# Altium schematic sheet H2E_Port.SchDoc
size A4
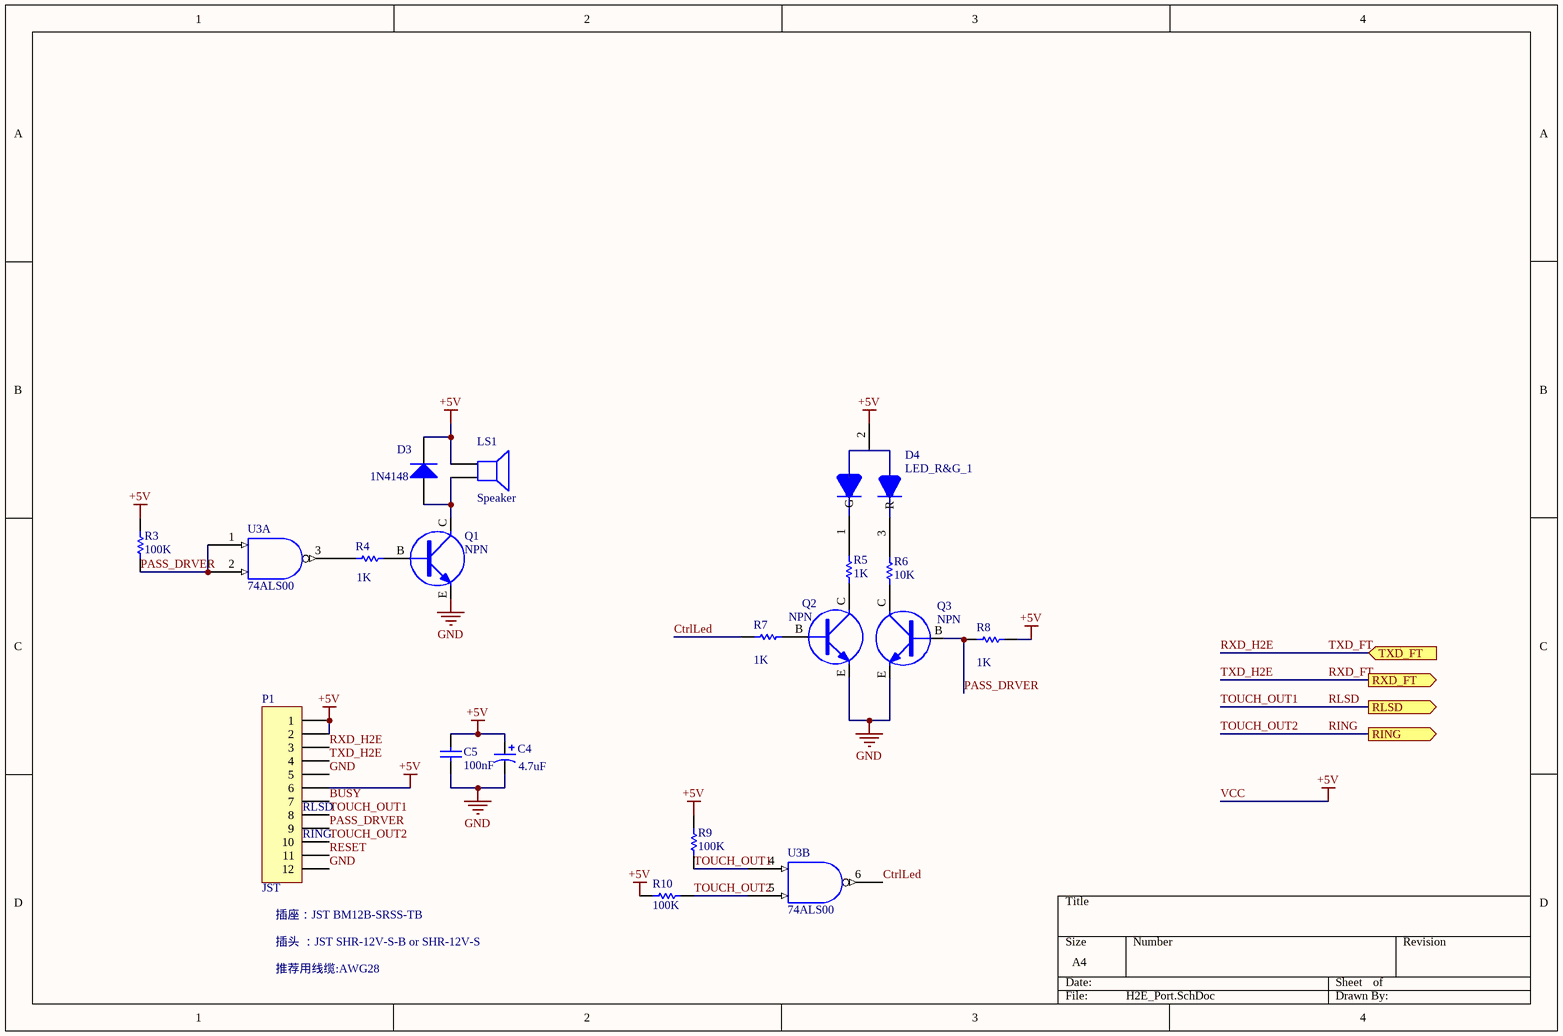
[diagram p0: H2E_Port.SchDoc]

## Parts
C4  value 4.7uF  [T3528]  (hidden comment: CAP+)
C5  value 100nF  [C0603]  (hidden comment: CAP)
D3  1N4148  [D1206]
D4  LED_R&G_1  [LED_R&G]
LS1  Speaker  [BUZZER]
P1  JST  [JST BM12B-SRSS-TB]
Q1  NPN  [SOT23/BEC]
Q2  NPN  [SOT23/BEC]
Q3  NPN  [SOT23/BEC]
R3  value 100K  [R0603]  (hidden comment: Res1)
R4  value 1K  [R0603]  (hidden comment: Res1)
R5  value 1K  [R0603]  (hidden comment: Res1)
R6  value 10K  [R0603]  (hidden comment: Res1)
R7  value 1K  [R0603]  (hidden comment: Res1)
R8  value 1K  [R0603]  (hidden comment: Res1)
R9  value 100K  [R0603]  (hidden comment: Res1)
R10  value 100K  [R0603]  (hidden comment: Res1)
U3  74ALS00  [SOIC-14]  (parts A,B of 4)

## Ports
RING (out), RLSD (out), RXD_FT (out), TXD_FT (in)

## Nets
GND: C4.2 C5.1 P1.5 P1.12 Q1.E Q2.E Q3.E U3.7(GND)
VCC: C4.1 C5.2 D3.2(K) D4.2(P) LS1.1 P1.1 P1.2 P1.6 R3.2 R8.2 R9.2 R10.2 U3.14(VCC)  [also labelled +5V]
BUSY: P1.7
CtrlLed: R7.1 U3.6
PASS_DRVER: P1.9 Q3.B R3.1 R8.1 U3.1 U3.2
RESET: P1.11
RING: P1.10 R10.1 U3.5 ; port RING  [also labelled TOUCH_OUT2]
RLSD: P1.8 R9.1 U3.4 ; port RLSD  [also labelled TOUCH_OUT1]
RXD_FT: P1.4 ; port RXD_FT  [also labelled TXD_H2E]
RXD_H2E: P1.3 ; port TXD_FT  [also labelled TXD_FT]
NetD3_1: D3.1(A) LS1.2 Q1.C
NetD4_1: D4.1(G) R5.2
NetD4_3: D4.3(R) R6.2
NetQ1_B: Q1.B R4.2
NetQ2_B: Q2.B R7.2
NetQ2_C: Q2.C R5.1
NetQ3_C: Q3.C R6.1
NetR4_1: R4.1 U3.3

## Notes on the sheet
- (near P1) RLSD
- (near P1) RING
- (near P1) 插座：JST BM12B-SRSS-TB
- 插头 ：JST SHR-12V-S-B or SHR-12V-S
- 推荐用线缆:AWG28

## Library data of the parts
C5 = CAP: Capacitor
D3 = Diode 1N4148: High Conductance Fast Diode; Value: 1N4148
LS1 = Speaker: Loudspeaker; Published: 24-Mar-1999; LatestRevisionDate: 17-Jul-2002; LatestRevisionNote: Re-released for DXP Platform.; PackageReference: PIN2; Publisher: Altium Limited
P1 = Header 12: Header, 12-Pin; LatestRevisionDate: 17-Jul-2002; LatestRevisionNote: Re-released for DXP Platform.; Publisher: Altium Limited
Q1-Q3 = NPN: NPN Transistor; Value: *
R3-R10 = Res1: Resistor; Published: 8-Jun-2000; LatestRevisionDate: 17-Jul-2002; LatestRevisionNote: Re-released for DXP Platform.; PackageReference: AXIAL-0.3; Publisher: Altium Limited